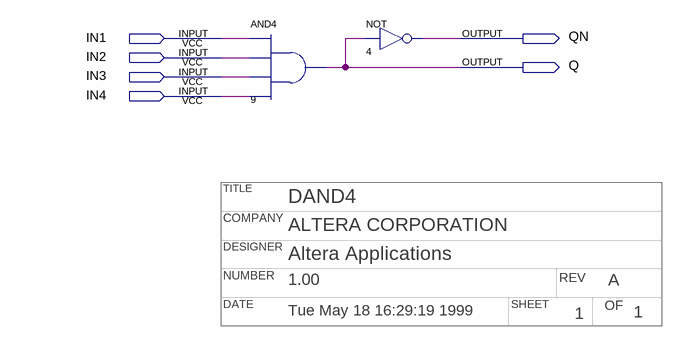
[diagram p0: schematic sheet]
// Quartus schematic dand4.bdf as structural Verilog: 2 symbols, 6 pins
// Title block: TITLE: DAND4; COMPANY: ALTERA CORPORATION; DESIGNER: Altera Applications; NUMBER: 1.00; REV: A; DATE: Tue May 18 16:29:19 1999; SHEET: 1; OF: 1
module dand4 (
  input  IN1,
  input  IN2,
  input  IN3,
  input  IN4,
  output QN,
  output Q
);

  and u_9 (Q, IN1, IN2, IN3, IN4);
  not u_4 (QN, Q);
endmodule
